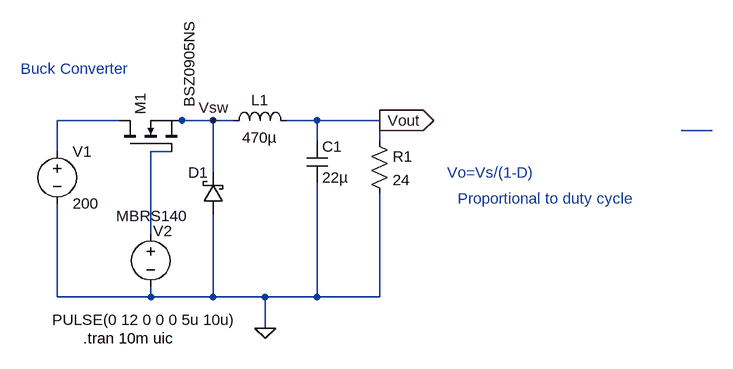
[diagram p0: schematic buck_boost_converter.asc]
buck_boost_converter.asc, the LTspice schematic file:
Version 4
SHEET 1 980 680
WIRE 64 80 -32 80
WIRE 160 80 144 80
WIRE 208 80 160 80
WIRE 240 80 208 80
WIRE 368 80 320 80
WIRE 464 80 368 80
WIRE 976 96 928 96
WIRE 368 112 368 80
WIRE 464 112 464 80
WIRE -32 128 -32 80
WIRE 144 128 112 128
WIRE 208 160 208 80
WIRE 112 256 112 128
WIRE -32 352 -32 208
WIRE 112 352 112 336
WIRE 112 352 -32 352
WIRE 208 352 208 224
WIRE 208 352 112 352
WIRE 288 352 208 352
WIRE 368 352 368 176
WIRE 368 352 288 352
WIRE 464 352 464 192
WIRE 464 352 368 352
WIRE 288 400 288 352
FLAG 288 400 0
FLAG 464 80 Vout
IOPIN 464 80 Out
FLAG 208 80 Vsw
SYMBOL voltage -32 112 R0
WINDOW 123 0 0 Left 0
WINDOW 39 0 0 Left 0
SYMATTR InstName V1
SYMATTR Value 200
SYMBOL ind 224 96 R270
WINDOW 0 32 56 VTop 2
WINDOW 3 5 56 VBottom 2
SYMATTR InstName L1
SYMATTR Value 470µ
SYMBOL nmos 64 128 R270
WINDOW 3 68 107 Left 2
SYMATTR InstName M1
SYMATTR Value BSZ0905NS
SYMBOL voltage 112 240 R0
WINDOW 123 0 0 Left 0
WINDOW 39 0 0 Left 0
WINDOW 0 4 10 Left 2
WINDOW 3 -152 147 Left 2
SYMATTR InstName V2
SYMATTR Value PULSE(0 12 0 0 0 5u 10u)
SYMBOL cap 352 112 R0
SYMATTR InstName C1
SYMATTR Value 22µ
SYMBOL res 448 96 R0
SYMATTR InstName R1
SYMATTR Value 24
SYMBOL schottky 224 224 R180
WINDOW 0 24 64 Left 2
WINDOW 3 56 -3 Left 2
SYMATTR InstName D1
SYMATTR Value MBRS140
SYMATTR Description Diode
SYMATTR Type diode
TEXT 8 416 Left 2 !.tran 10m uic
TEXT -88 0 Left 2 ;Buck Converter
TEXT 568 160 Left 2 ;Vo=Vs/(1-D)
TEXT 584 200 Left 2 ;Proportional to duty cycle

The netlist it stands for:
* buck_boost_converter.asc
V1 N001 0 200
L1 Vsw Vout 470µ
M1 N001 N003 Vsw Vsw BSZ0905NS
V2 N003 0 PULSE(0 12 0 0 0 5u 10u)
C1 Vout 0 22µ
R1 Vout 0 24
D1 0 Vsw MBRS140
.model D D
.lib standard.dio
.model NMOS NMOS
.model PMOS PMOS
.lib standard.mos
.tran 10m uic
* Buck Converter
* Vo=Vs/(1-D)
* Proportional to duty cycle
.backanno
.end